# EAGLE schematic CVSummer (EAGLE 7.7.0)
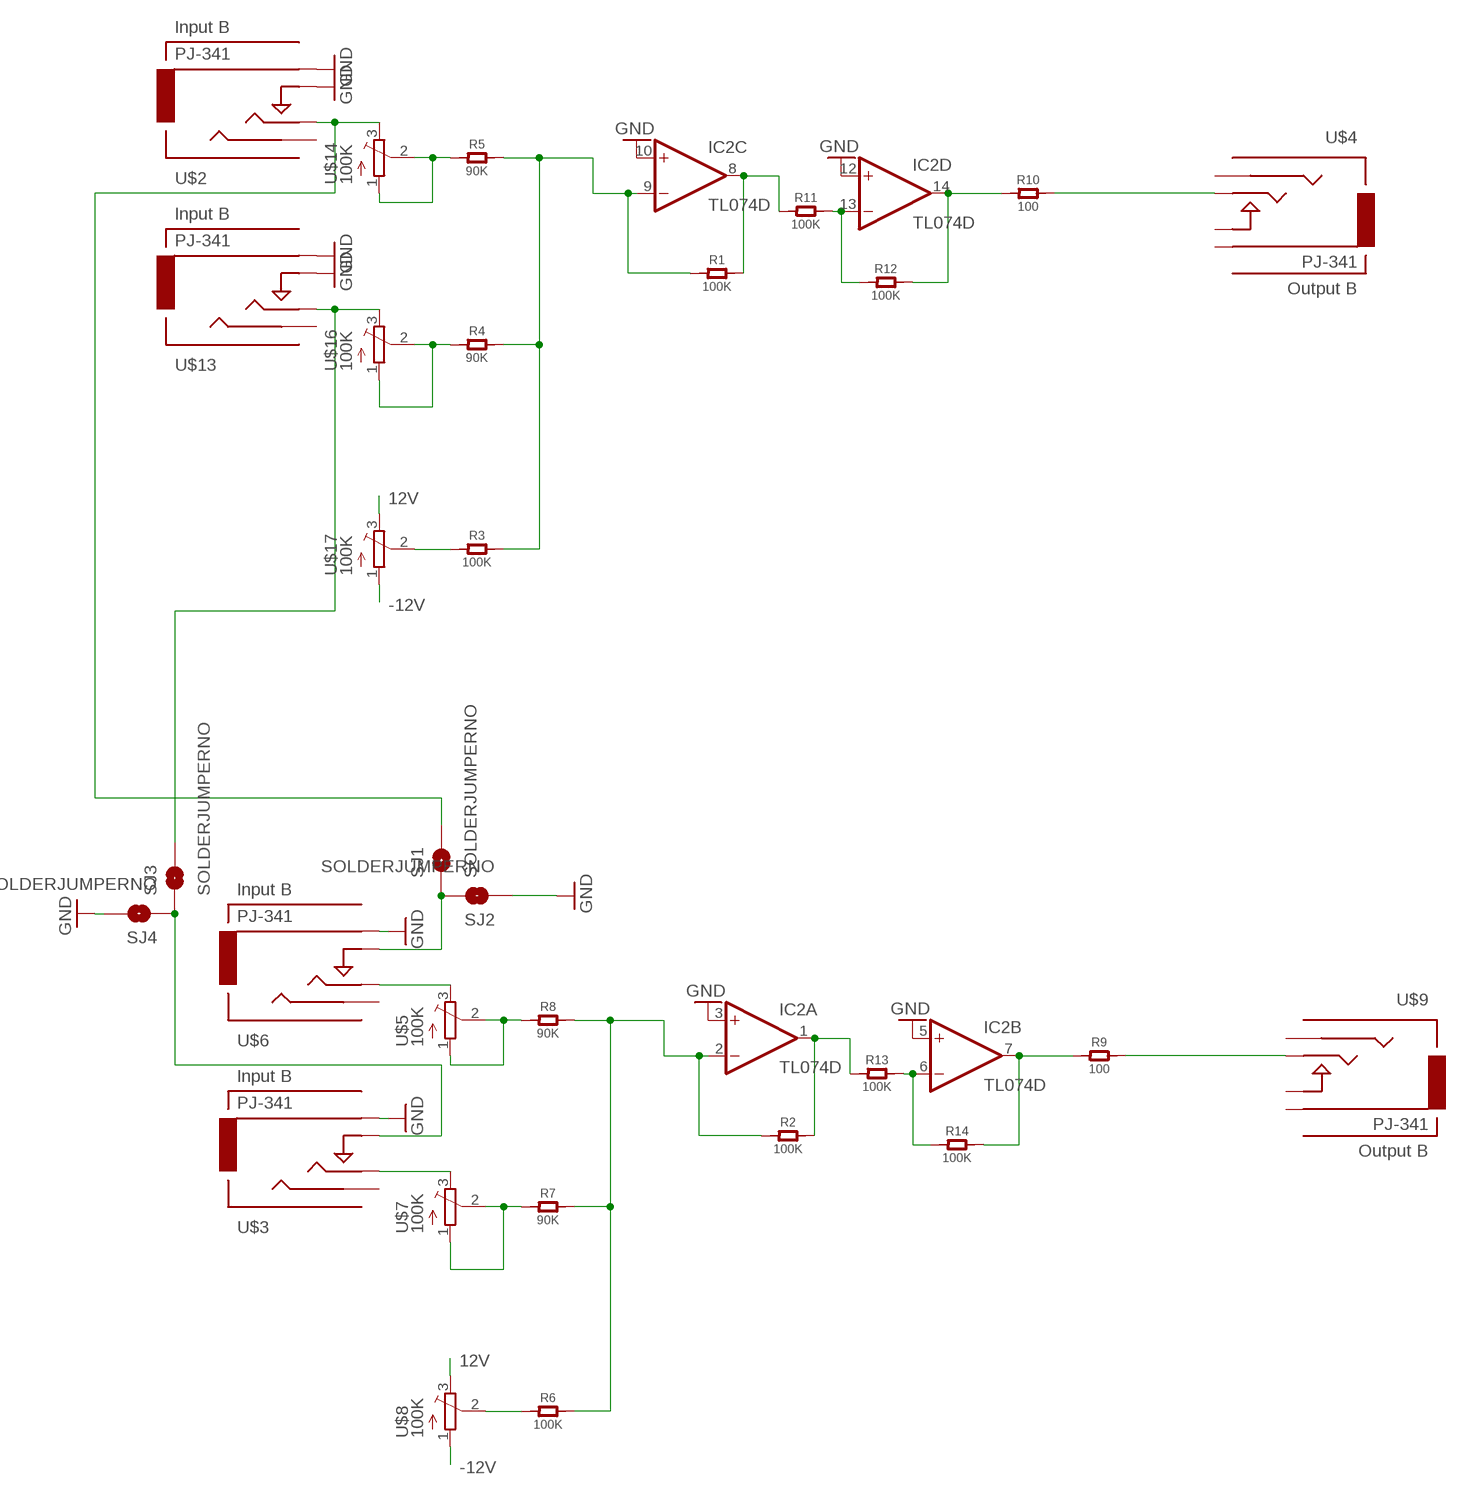
[diagram p0: schematic, sheet 1, part 1 of 2]
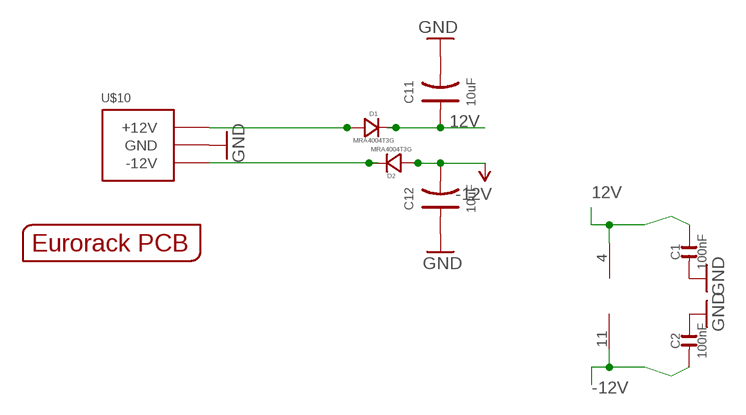
[diagram p1: schematic, sheet 1, part 2 of 2]

## Parts
C1  100nF  C-0603  [C0603]
C2  100nF  C-0603  [C0603]
C11  10uF  C-POLAR-A  [AVX-A]
C12  10uF  C-POLAR-A  [AVX-A]
D1  MRA4004T3G  D-SMA  [DO-214AC]
D2  MRA4004T3G  D-SMA  [DO-214AC]
IC2  TL074D  [SO14]
R1  100K  R  [C0805]
R2  100K  R  [C0805]
R3  100K  R  [C0805]
R4  90K  R  [C0805]
R5  90K  R  [C0805]
R6  100K  R  [C0805]
R7  90K  R  [C0805]
R8  90K  R  [C0805]
R9  100  R  [C0805]
R10  100  R  [C0805]
R11  100K  R  [C0805]
R12  100K  R  [C0805]
R13  100K  R  [C0805]
R14  100K  R  [C0805]
SJ1  SOLDERJUMPERNO  [SJ_2S-NO]
SJ2  SOLDERJUMPERNO  [SJ_2S-NO]
SJ3  SOLDERJUMPERNO  [SJ_2S-NO]
SJ4  SOLDERJUMPERNO  [SJ_2S-NO]
U$1  EURORACK_PCB4HP  [EURORACK4HPPCB]
U$2  PJ-341  AUDIO-JACKINPUT  [3.5MM-JACK-SWITCH-13MM-INPUT]
U$3  PJ-341  AUDIO-JACKINPUT  [3.5MM-JACK-SWITCH-13MM-INPUT]
U$4  PJ-341  AUDIO-JACKOUTPUT  [3.5MM-JACK-SWITCH-13MM-OUTPUT]
U$5  100K  TRIMPOTTC33X  [TC33X]
U$6  PJ-341  AUDIO-JACKINPUT  [3.5MM-JACK-SWITCH-13MM-INPUT]
U$7  100K  TRIMPOTTC33X  [TC33X]
U$8  100K  TRIMPOTTC33X  [TC33X]
U$9  PJ-341  AUDIO-JACKOUTPUT  [3.5MM-JACK-SWITCH-13MM-OUTPUT]
U$10  POWER_SIMPLE10  [POWER_10]
U$13  PJ-341  AUDIO-JACKINPUT  [3.5MM-JACK-SWITCH-13MM-INPUT]
U$14  100K  TRIMPOTTC33X  [TC33X]
U$16  100K  TRIMPOTTC33X  [TC33X]
U$17  100K  TRIMPOTTC33X  [TC33X]

## Nets
12V: C1.2 C11.+ D1.2(-) IC2.4(P:V+) U$8.3(E) U$17.3(E)
-12V: C2.1 C12.- D2.1(+) IC2.11(P:V-) U$8.1(A) U$17.1(A)
GND: C1.1 C2.2 C11.- C12.+ IC2.3(A:+IN) IC2.5(B:+IN) IC2.10(C:+IN) IC2.12(D:+IN) SJ2.1 SJ4.2 U$2.RING@3(RING) U$2.SWITCH@3(SWITCH) U$3.RING@3(RING) U$6.RING@3(RING) U$10.3(GND) U$10.4(GND) U$10.5(GND) U$10.6(GND) U$10.7(GND) U$10.8(GND) U$13.RING@3(RING) U$13.SWITCH@3(SWITCH)
N$1: SJ1.1 SJ2.2 U$6.SWITCH@3(SWITCH)
N$2: IC2.14(D:OUT) R10.1 R12.2
N$3: R5.1 U$14.1(A) U$14.2(S)
N$4: U$5.3(E) U$6.TIP@3(TIP)
N$5: IC2.7(B:OUT) R9.1 R14.2
N$6: R3.1 U$17.2(S)
N$7: IC2.8(C:OUT) R1.2 R11.1
N$8: IC2.13(D:-IN) R11.2 R12.1
N$9: R6.1 U$8.2(S)
N$10: R4.1 U$16.1(A) U$16.2(S)
N$11: U$3.TIP@3(TIP) U$7.3(E)
N$12: SJ3.2 U$13.TIP@3(TIP) U$16.3(E)
N$13: IC2.2(A:-IN) R2.1 R6.2 R7.2 R8.2
N$14: IC2.9(C:-IN) R1.1 R3.2 R4.2 R5.2
N$15: R9.2 U$9.TIP@3(TIP)
N$16: R8.1 U$5.1(A) U$5.2(S)
N$17: R7.1 U$7.1(A) U$7.2(S)
N$18: IC2.1(A:OUT) R2.2 R13.1
N$19: IC2.6(B:-IN) R13.2 R14.1
N$20: SJ1.2 U$2.TIP@3(TIP) U$14.3(E)
N$21: SJ3.1 SJ4.1 U$3.SWITCH@3(SWITCH)
N$22: R10.2 U$4.TIP@3(TIP)
N$28 [heavypower]: D1.1(+) U$10.9(+12V) U$10.10(+12V)
N$64 [heavypower]: D2.2(-) U$10.1(-12V) U$10.2(-12V)
Unconnected: U$2.SECOND@3(SECOND) U$3.SECOND@3(SECOND) U$4.RING@3(RING) U$4.SECOND@3(SECOND) U$4.SWITCH@3(SWITCH) U$6.SECOND@3(SECOND) U$9.RING@3(RING) U$9.SECOND@3(SECOND) U$9.SWITCH@3(SWITCH) U$13.SECOND@3(SECOND)

## Library data of the parts
C1 C2 = OPL:C*
C11 C12 = OPL:C-POLAR*
D1 D2 = OPL:D*: DIODE; MF: VISHAY; MPN: US1G-E3/5AT; OC_FARNELL: 9551824
IC2 = EurorackModularParts:TL074: OP AMP
R1-R14 = OPL:R*
SJ1-SJ4 = SparkFun-Passives:SOLDERJUMPER: Solder Jumper Standard SMD solder jumper. Used to automate production. Two varients : Normally Open and Normally Closed are the same, but have different paste layers. NC will have a large amount of paste and should jumper during reflow.
U$1 = EurorackModularParts:EURORACK_PCB
U$2 U$3 U$6 U$13 = EurorackModularParts:AUDIO-JACK: Switching Mono 3.5mm Audio Jack from Erthenvar.; DESC: Input B; MPN: PJ-341
U$4 U$9 = EurorackModularParts:AUDIO-JACK: Switching Mono 3.5mm Audio Jack from Erthenvar.; DESC: Output B; MPN: PJ-341
U$5 U$7 U$8 U$14 U$16 U$17 = adafruit:TRIMPOT: SMT trimmer potentiometer part number TC33X http://www.ladyada.net/library/eagle
U$10 = EurorackModularParts:POWER_SIMPLE

## Net classes
0 default: width 0.305 mm
1 heavypower: width 0.381 mm